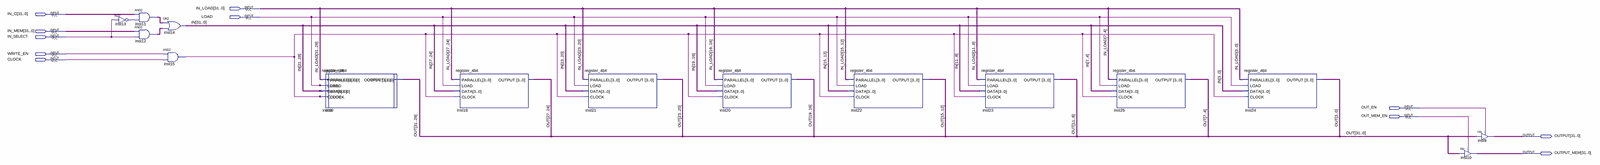
[diagram p0: schematic sheet, whole]
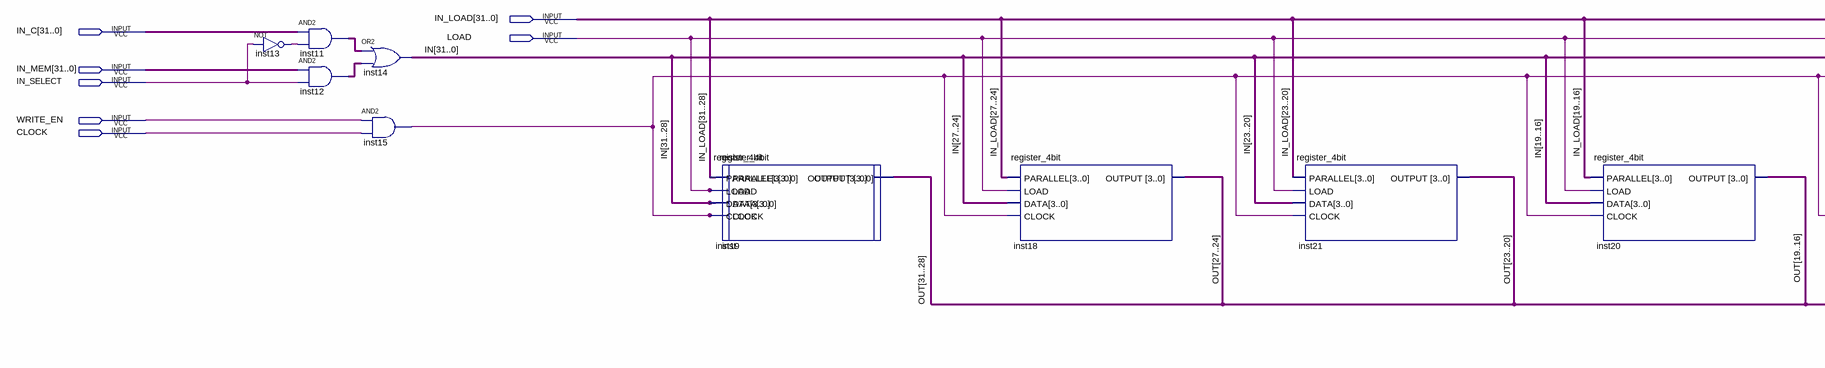
[diagram p1: schematic sheet, left part]
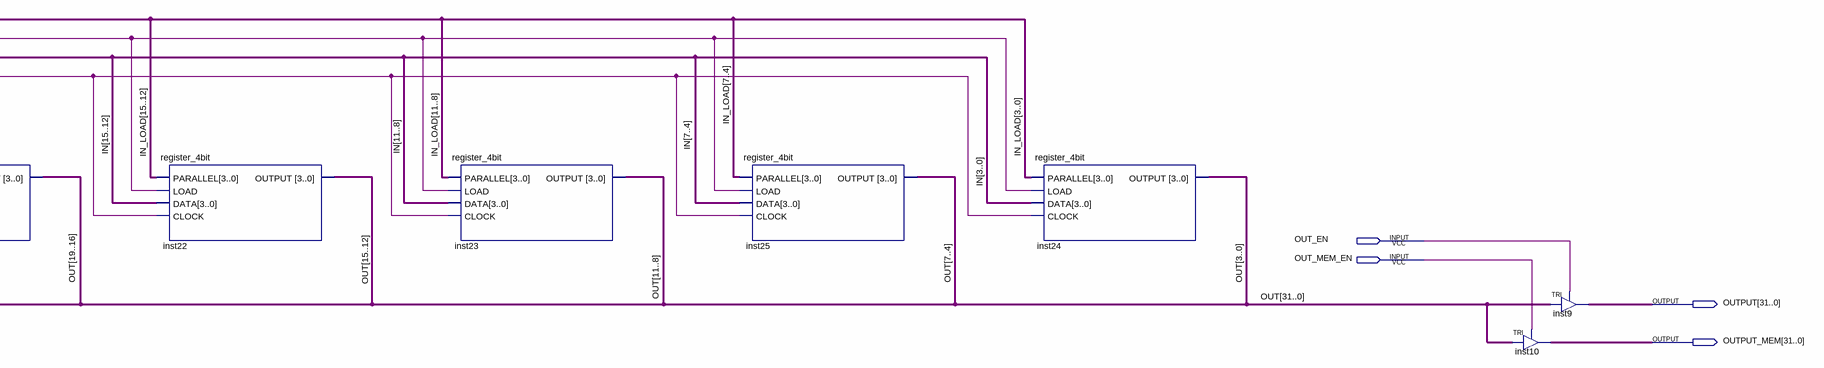
[diagram p2: schematic sheet, right part]
// Quartus schematic register_32bit.bdf as structural Verilog: 16 symbols, 11 pins
module register_32bit (
  input  [31:0] IN_LOAD,
  input  [31:0] IN_C,
  input  LOAD,
  input  [31:0] IN_MEM,
  input  IN_SELECT,
  input  WRITE_EN,
  input  CLOCK,
  input  OUT_EN,
  input  OUT_MEM_EN,
  output [31:0] OUTPUT,
  output [31:0] OUTPUT_MEM
);

  wire inst13_out, inst15_out;
  wire [31:0] IN, inst11_out, inst12_out, OUT;

  not inst13 (inst13_out, IN_SELECT);
  assign inst11_out = IN_C & {32{inst13_out}};  // AND2 inst11, 32 bits wide
  assign inst12_out = IN_MEM & {32{IN_SELECT}};  // AND2 inst12, 32 bits wide
  assign IN = inst11_out | inst12_out;  // OR2 inst14, 32 bits wide
  and inst15 (inst15_out, WRITE_EN, CLOCK);
  register_4bit inst (
    .PARALLEL(IN_LOAD[31:28]), .LOAD(LOAD), .DATA(IN[31:28]), .CLOCK(inst15_out), .OUTPUT(OUT[31:28]));
  register_4bit inst19 (.PARALLEL(IN_LOAD[31:28]), .LOAD(LOAD), .DATA(IN[31:28]), .CLOCK(inst15_out));  // open: OUTPUT
  register_4bit inst18 (
    .PARALLEL(IN_LOAD[27:24]), .LOAD(LOAD), .DATA(IN[27:24]), .CLOCK(inst15_out), .OUTPUT(OUT[27:24]));
  register_4bit inst21 (
    .PARALLEL(IN_LOAD[23:20]), .LOAD(LOAD), .DATA(IN[23:20]), .CLOCK(inst15_out), .OUTPUT(OUT[23:20]));
  register_4bit inst20 (
    .PARALLEL(IN_LOAD[19:16]), .LOAD(LOAD), .DATA(IN[19:16]), .CLOCK(inst15_out), .OUTPUT(OUT[19:16]));
  register_4bit inst22 (
    .PARALLEL(IN_LOAD[15:12]), .LOAD(LOAD), .DATA(IN[15:12]), .CLOCK(inst15_out), .OUTPUT(OUT[15:12]));
  register_4bit inst23 (.PARALLEL(IN_LOAD[11:8]), .LOAD(LOAD), .DATA(IN[11:8]), .CLOCK(inst15_out), .OUTPUT(OUT[11:8]));
  register_4bit inst25 (.PARALLEL(IN_LOAD[7:4]), .LOAD(LOAD), .DATA(IN[7:4]), .CLOCK(inst15_out), .OUTPUT(OUT[7:4]));
  register_4bit inst24 (.PARALLEL(IN_LOAD[3:0]), .LOAD(LOAD), .DATA(IN[3:0]), .CLOCK(inst15_out), .OUTPUT(OUT[3:0]));
  TRI inst9[31:0] (.IN(OUT), .OE(OUT_EN), .OUT(OUTPUT));
  TRI inst10[31:0] (.IN(OUT), .OE(OUT_MEM_EN), .OUT(OUTPUT_MEM));
endmodule
